# EAGLE design External_Power_Supply (EAGLE 6.4)
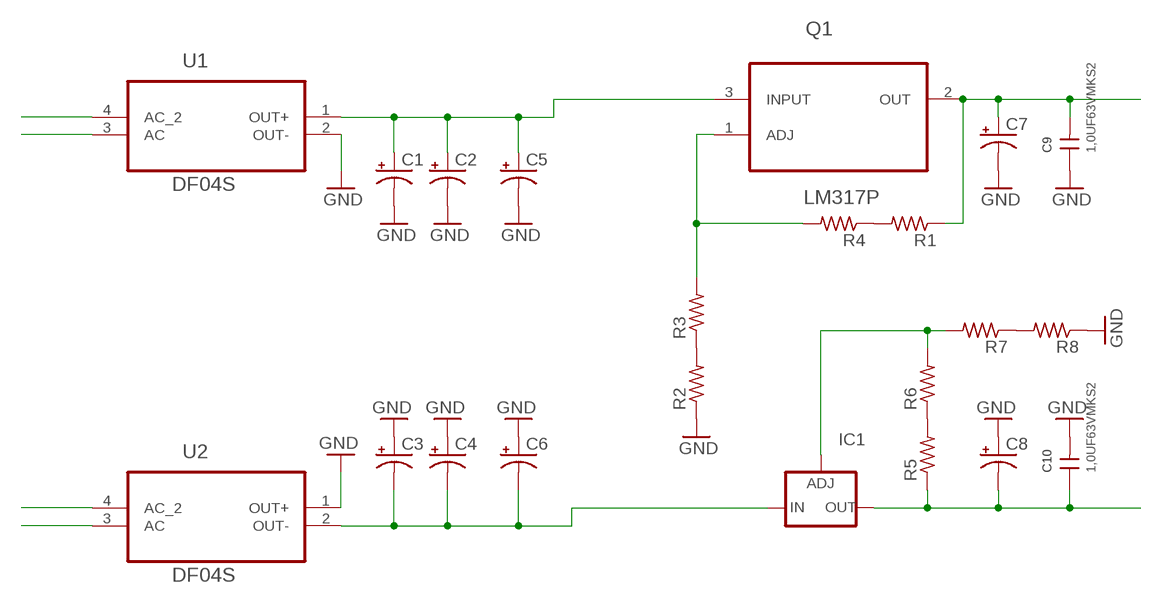
[diagram p0: schematic, sheet 1]

## Parts
C1  CPOL-US153CLV-1010  [153CLV-1010]
C2  CPOL-US153CLV-1010  [153CLV-1010]
C3  CPOL-US153CLV-1010  [153CLV-1010]
C4  CPOL-US153CLV-1010  [153CLV-1010]
C5  CPOL-USF  [PANASONIC_F]
C6  CPOL-USF  [PANASONIC_F]
C7  CPOL-USF  [PANASONIC_F]
C8  CPOL-USF  [PANASONIC_F]
C9  1,0UF63VMKS2  [5,0X10,0RM5,0]
C10  1,0UF63VMKS2  [5,0X10,0RM5,0]
IC1  LM337TS  [337TS]
Q1  LM317P  [TO254P450X1020X2000-3P]
R1  R-US_R0603  [R0603]
R2  R-US_R0603  [R0603]
R3  R-US_R0603  [R0603]
R4  R-US_R0603  [R0603]
R5  R-US_R0603  [R0603]
R6  R-US_R0603  [R0603]
R7  R-US_R0603  [R0603]
R8  R-US_R0603  [R0603]
U1  DF04S  [SOT508P985X260-4N]
U2  DF04S  [SOT508P985X260-4N]

## Nets
GND: C1.- C2.- C3.+ C4.+ C5.- C6.+ C7.- C8.+ C9.1 C10.2 R2.1 R8.1 U1.2(OUT-) U2.1(OUT+)
N$1: R2.2 R3.1
N$2: C1.+ C2.+ C5.+ Q1.3(INPUT) U1.1(OUT+)
N$3: C3.- C4.- C6.- IC1.2(IN) U2.2(OUT-)
N$4: C7.+ C9.2 Q1.2(OUT) R1.1
N$5: C8.- C10.1 IC1.3(OUT) R5.1
N$6: Q1.1(ADJ) R3.2 R4.2
N$7: IC1.1(ADJ) R6.2 R7.2
N$8: U1.4(AC_2)
N$9: U1.3(AC)
N$10: U2.4(AC_2)
N$11: U2.3(AC)
N$12: R1.2 R4.1
N$13: R5.2 R6.1
N$14: R7.1 R8.2

## Library data of the parts
C1-C8 = rcl:CPOL-US: POLARIZED CAPACITOR, American symbol
C9 C10 = wima_c:1,0UF63V
IC1 = v-reg:LM337TS: VOLTAGE REGULATOR
Q1 = ST Microelctronics_By_element14_Batch_1:LM317P: 1.2 V to 37 V adjustable voltage regulators; MPN: LM317P; OC_FARNELL: 1703358; OC_NEWARK: 89K0684; PACKAGE: TO-220; SUPPLIER: STMicroelectronics
R1-R8 = rcl:R-US_: RESISTOR, American symbol
U1 U2 = Fairchild_By_element14_Batch_1:DF04S: Bridge Rectifiers; MPN: DF04S; OC_FARNELL: 1467469; OC_NEWARK: 18C6124; PACKAGE: SDIP-4; SUPPLIER: Fairchild

## Board
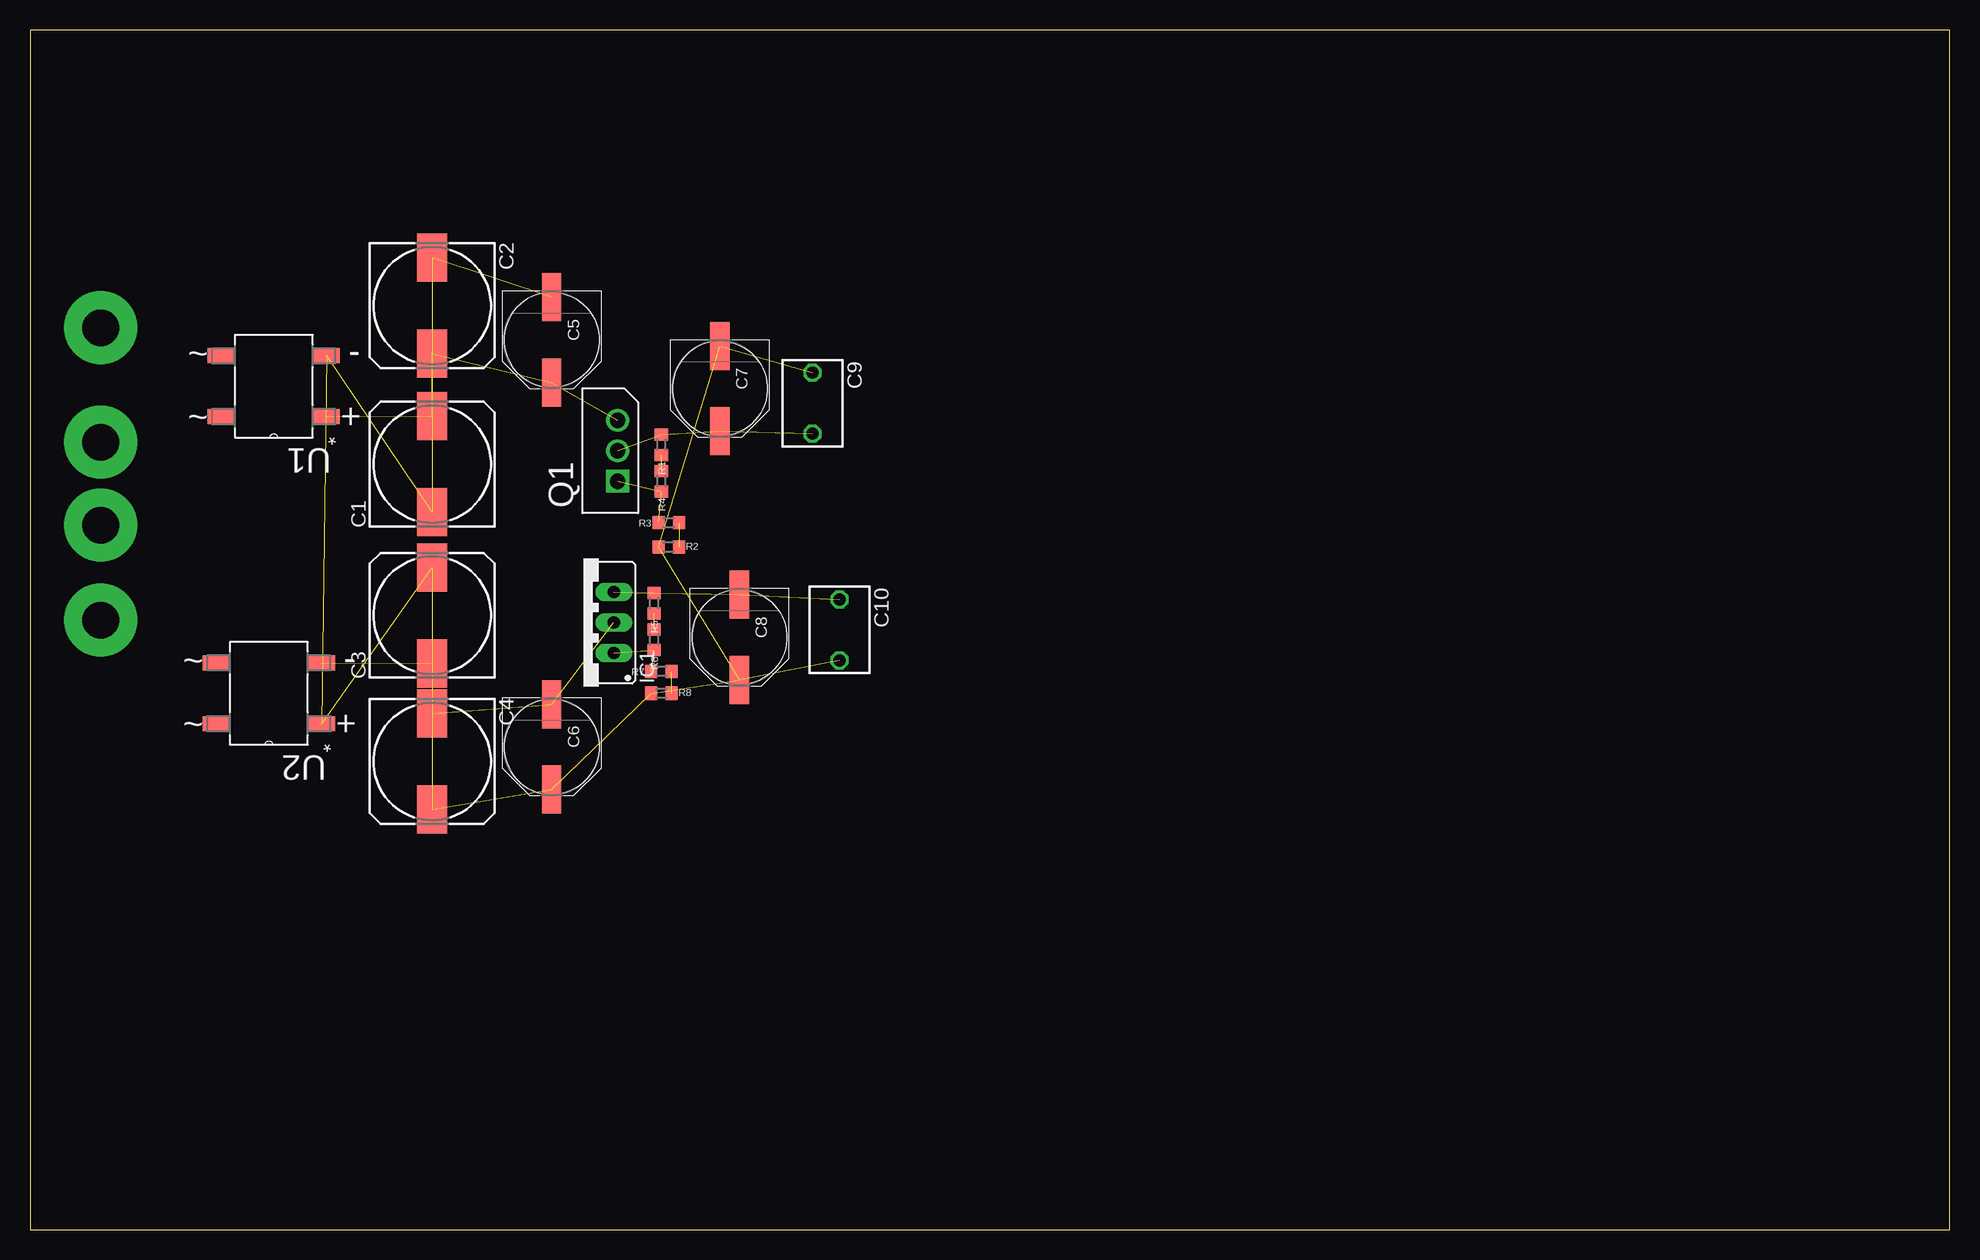
[diagram p1: board, top side]

Size 160 x 100 mm. Coordinates in mm from the lower left corner, seen from the top.
Outline: 0,0 160,0 160,100 0,100 0,0
Copper layers (1*16): Top 0.035mm / dielectric 1.5mm / Bottom 0.035mm
Design rules "default": minimum track width 10mil, minimum drill 24mil, track to track 8mil, track to pad 8mil, pad to pad 8mil, via to via 8mil, smd to smd 8mil, copper to edge 40mil, drill to drill 8mil, minimum pad ring 10mil, minimum via ring 8mil, stop-mask expansion 4mil, vias tented up to drill 0mil, thermal gap 10mil

### Footprints (pad centres in the part's own frame; a part is rotated, then mirrored left to right if it is on the bottom)
153CLV-1010 = smd 4 x 2.5: + 4,0; - -4,0
PANASONIC_F = smd 4 x 1.6: + 3.55,0; - -3.55,0
5,0X10,0RM5,0 = drill 1 pad 1.5 octagon: 1 -2.54,0; 2 2.54,0
337TS = drill 1.016 long: 1 -2.54,-2.54; 2 0,-2.54; 3 2.54,-2.54
TO254P450X1020X2000-3P = drill 1.27 square: 1 -5.08,-1.219 | drill 1.27: 2 -2.54,-1.219; 3 0,-1.219
R0603 = smd 1 x 1.1: 1 -0.85,0; 2 0.85,0
SOT508P985X260-4N = smd 2.235 x 1.245: 1 -4.394,2.54; 2 -4.394,-2.54; 3 4.394,-2.54; 4 4.394,2.54

### Placement (x,y rotation side)
C1  33.53,63.8 90 top
C2  33.53,77.01 270 top
C3  33.53,51.21 90 top
C4  33.53,39.01 270 top
C5  43.48,74.17 270 top
C6  43.48,40.23 270 top
C7  57.51,70.1 270 top
C8  59.13,49.38 270 top
C9  65.23,68.88 270 top
C10  67.46,49.99 270 top
IC1  46.13,50.6 90 top
Q1  47.75,67.46 90 top
R1  52.63,65.43 270 top
R2  53.24,56.9 0 top
R3  53.24,58.93 180 top
R4  52.63,62.38 270 top
R5  52.02,52.22 270 top
R6  52.02,49.17 270 top
R7  52.63,46.53 180 top
R8  52.63,44.7 0 top
U1  20.32,70.31 180 top
U2  19.91,44.7 180 top

### Tracks (layer width: path | path; a pad name or v marks a point on that pad's centre or on a via)
GND  (13 unrouted)
N$1  (1 unrouted)
N$2  (4 unrouted)
N$3  (4 unrouted)
N$4  (3 unrouted)
N$5  (3 unrouted)
N$6  (2 unrouted)
N$7  (2 unrouted)
N$12  (1 unrouted)
N$13  (1 unrouted)
N$14  (1 unrouted)
N$15  (via drill 3.05 pad 6.1)
  other vias: 5.89,75.18
N$16  (via drill 3.05 pad 6.1)
  other vias: 5.89,65.63
N$17  (via drill 3.05 pad 6.1)
  other vias: 5.89,58.72
N$18  (via drill 3.05 pad 6.1)
  other vias: 5.89,50.8